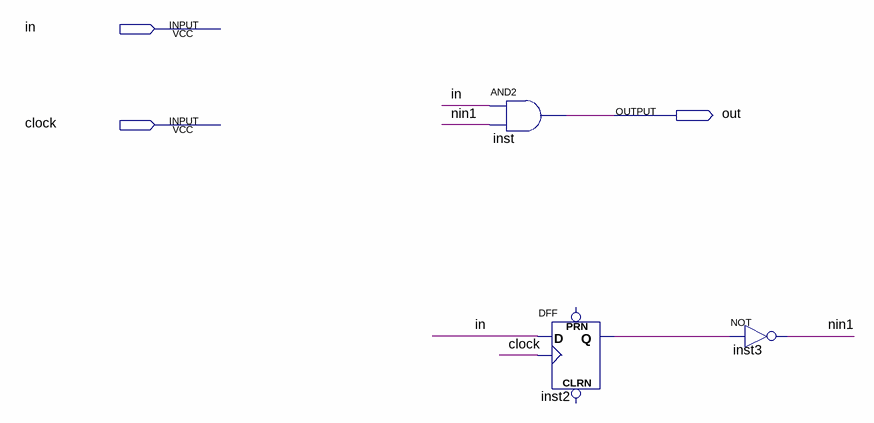
[diagram p0: schematic sheet]
// Quartus schematic risingedge.bdf as structural Verilog: 3 symbols, 3 pins
module risingedge (
  input  in,
  input  clock,
  output out
);

  wire inst2_q, nin1;

  and inst (out, in, nin1);
  DFF inst2 (.CLK(clock), .D(in), .Q(inst2_q));  // open: CLRN, PRN
  not inst3 (nin1, inst2_q);
endmodule
